# Altium project F103CB-CoreBrd.PrjPCB
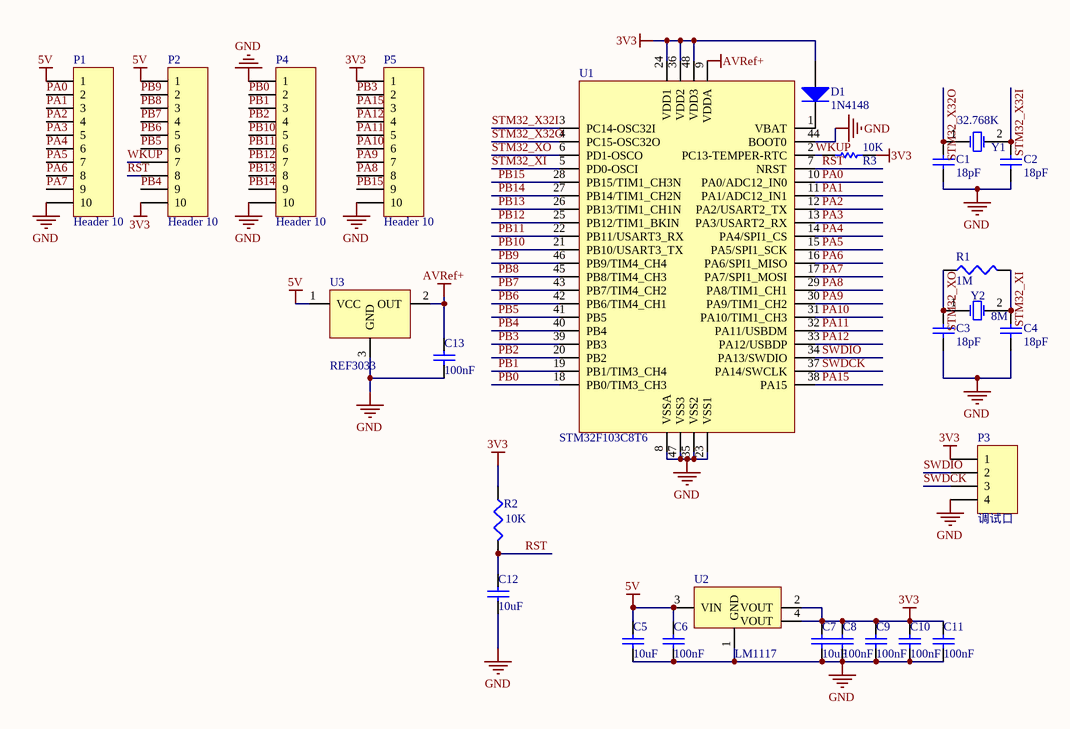
[diagram p0: Sheet1.SchDoc]
1 sheet, 27 parts. Net scope: global (net labels, ports and power ports of the same name join across sheets).
Board file: PCB1.PcbDoc

## Sheet Sheet1.SchDoc
size A4

### Parts
C1  value 18pF  [6-0805_N]  (hidden comment: Cap)
C2  value 18pF  [6-0805_N]  (hidden comment: Cap)
C3  value 18pF  [6-0805_N]  (hidden comment: Cap)
C4  value 18pF  [6-0805_N]  (hidden comment: Cap)
C5  value 10uF  [6-0805_N]  (hidden comment: Cap)
C6  value 100nF  [6-0805_N]  (hidden comment: Cap)
C7  value 10uF  [6-0805_N]  (hidden comment: Cap)
C8  value 100nF  [6-0805_N]  (hidden comment: Cap)
C9  value 100nF  [6-0805_N]  (hidden comment: Cap)
C10  value 100nF  [6-0805_N]  (hidden comment: Cap)
C11  100nF  [6-0805_N]
C12  value 10uF  [6-0805_N]  (hidden comment: Cap)
C13  100nF  [6-0805_N]
D1  1N4148  [C1206]
P1  Header 10  [HDR1X10]
P2  Header 10  [HDR1X10]
P3  调试口  [HDR1X4]
P4  Header 10  [HDR1X10]
P5  Header 10  [HDR1X10]
R1  value 1M  [6-0805_N]  (hidden comment: Res3)
R2  value 10K  [6-0805_N]  (hidden comment: Res3)
R3  value 10K  [6-0805_N]  (hidden comment: Res1)
U1  STM32F103C8T6  [LQFP48-7x7]
U2  LM1117  [SOT223_N]
U3  REF3033  [SOT-23_N]
Y1  32.768K  [XTAL-3215]
Y2  8M  [XTAL-5032]

### Nets
3V3: C7.2 C8.2 C9.2 C10.2 C11.2 D1.1(A) P2.10 P3.1 P5.1 R2.1 R3.2 U1.24(VDD1) U1.36(VDD2) U1.48(VDD3) U2.2(VOUT) U2.4(VOUT)
5V: C5.2 C6.2 P1.1 P2.1 U2.3(VIN) U3.1(VCC)
AVRef+: C13.2 U1.9(VDDA) U3.2(OUT)
GND: C1.2 C2.2 C3.2 C4.2 C5.1 C6.1 C7.1 C8.1 C9.1 C10.1 C11.1 C12.1 C13.1 P1.10 P3.4 P4.1 P4.10 P5.10 U1.8(VSSA) U1.23(VSS1) U1.35(VSS2) U1.44(BOOT0) U1.47(VSS3) U2.1(GND) U3.3(GND)
PA0: P1.2 U1.10(PA0/ADC12_IN0)
PA1: P1.3 U1.11(PA1/ADC12_IN1)
PA2: P1.4 U1.12(PA2/USART2_TX)
PA3: P1.5 U1.13(PA3/USART2_RX)
PA4: P1.6 U1.14(PA4/SPI1_CS)
PA5: P1.7 U1.15(PA5/SPI1_SCK)
PA6: P1.8 U1.16(PA6/SPI1_MISO)
PA7: P1.9 U1.17(PA7/SPI1_MOSI)
PA8: P5.8 U1.29(PA8/TIM1_CH1)
PA9: P5.7 U1.30(PA9/TIM1_CH2)
PA10: P5.6 U1.31(PA10/TIM1_CH3)
PA11: P5.5 U1.32(PA11/USBDM)
PA12: P5.4 U1.33(PA12/USBDP)
PA15: P5.3 U1.38(PA15)
PB0: P4.2 U1.18(PB0/TIM3_CH3)
PB1: P4.3 U1.19(PB1/TIM3_CH4)
PB2: P4.4 U1.20(PB2)
PB3: P5.2 U1.39(PB3)
PB4: P2.9 U1.40(PB4)
PB5: P2.6 U1.41(PB5)
PB6: P2.5 U1.42(PB6/TIM4_CH1)
PB7: P2.4 U1.43(PB7/TIM4_CH2)
PB8: P2.3 U1.45(PB8/TIM4_CH3)
PB9: P2.2 U1.46(PB9/TIM4_CH4)
PB10: P4.5 U1.21(PB10/USART3_TX)
PB11: P4.6 U1.22(PB11/USART3_RX)
PB12: P4.7 U1.25(PB12/TIM1_BKIN)
PB13: P4.8 U1.26(PB13/TIM1_CH1N)
PB14: P4.9 U1.27(PB14/TIM1_CH2N)
PB15: P5.9 U1.28(PB15/TIM1_CH3N)
RST: C12.2 P2.8 R2.2 U1.7(NRST)
STM32_X32I: C2.1 U1.3(PC14-OSC32I) Y1.2(OSC2)
STM32_X32O: C1.1 U1.4(PC15-OSC32O) Y1.1(OSC1)
STM32_XI: C4.1 R1.2 U1.5(PD0-OSCI) Y2.2(OSC2)
STM32_XO: C3.1 R1.1 U1.6(PD1-OSCO) Y2.1(OSC1)
SWDCK: P3.3 U1.37(PA14/SWCLK)
SWDIO: P3.2 U1.34(PA13/SWDIO)
WKUP: P2.7 R3.1 U1.2(PC13-TEMPER-RTC)
NetD1_2: D1.2(K) U1.1(VBAT)

### Library data of the parts
C1-C13 = Cap: Capacitor; Published: 8-Jun-2000; LatestRevisionDate: 17-Jul-2002; LatestRevisionNote: Re-released for DXP Platform.; PackageReference: RAD-0.3; Publisher: Altium Limited; PackageDescription: Radial Cap, Thru-Hole; 2 Leads; 0.3 in Pin Spacing
D1 = Diode 1N4148: High Conductance Fast Diode; Published: 8-Jun-2000; LatestRevisionDate: 17-Jul-2002; LatestRevisionNote: Re-released for DXP Platform.; DatasheetVersion: 1997; PackageReference: DO-35; Publisher: Altium Limited; PackageDescription: Diode, Axial; Body 3.8 x 1.9 mm (LxDia. max), Lead Dia. 0.53 mm (max); Code_JEDEC: DO-204-AH; ComponentLink1Description: Manufacturer Link; ComponentLink1URL: http://www.fairchildsemi.com/; ComponentLink2Description: Datasheet; ComponentLink2URL: http://www.fairchildsemi.com/ds/1N%2F1N4148.pdf
P1 P2 P4 P5 = Header 10: Header, 10-Pin; LatestRevisionDate: 17-Jul-2002; LatestRevisionNote: Re-released for DXP Platform.; Publisher: Altium Limited
P3 = Header 4: Header, 4-Pin; LatestRevisionDate: 17-Jul-2002; LatestRevisionNote: Re-released for DXP Platform.; Publisher: Altium Limited
R1 R2 = Res3: Resistor; Published: 8-Jun-2000; LatestRevisionDate: 29-May-2009; LatestRevisionNote: IPC-7351 Footprint Added.; PackageReference: J1-0603; Publisher: Altium Limited; PackageDescription: Chip Resistor
R3 = Res1: Resistor; Published: 8-Jun-2000; LatestRevisionDate: 17-Jul-2002; LatestRevisionNote: Re-released for DXP Platform.; PackageReference: AXIAL-0.3; Publisher: Altium Limited; PackageDescription: Axial Device, Thru-Hole; 2 Leads; 0.3 in Pin Spacing
U1 = STM32F103CxT6
U3 = REF30xx
Y1 Y2 = XTAL: Crystal Oscillator; Published: 8-Jun-2000; LatestRevisionDate: 17-Jul-2002; LatestRevisionNote: Re-released for DXP Platform.; PackageReference: R38; Publisher: Altium Limited; PackageDescription: Crystal, Thru-Hole; 2 Leads; Body 3.1 x 8.2 mm (Dia.xH)